# EAGLE schematic falownik (EAGLE 9.0.1)

## Sheet 1 of 3
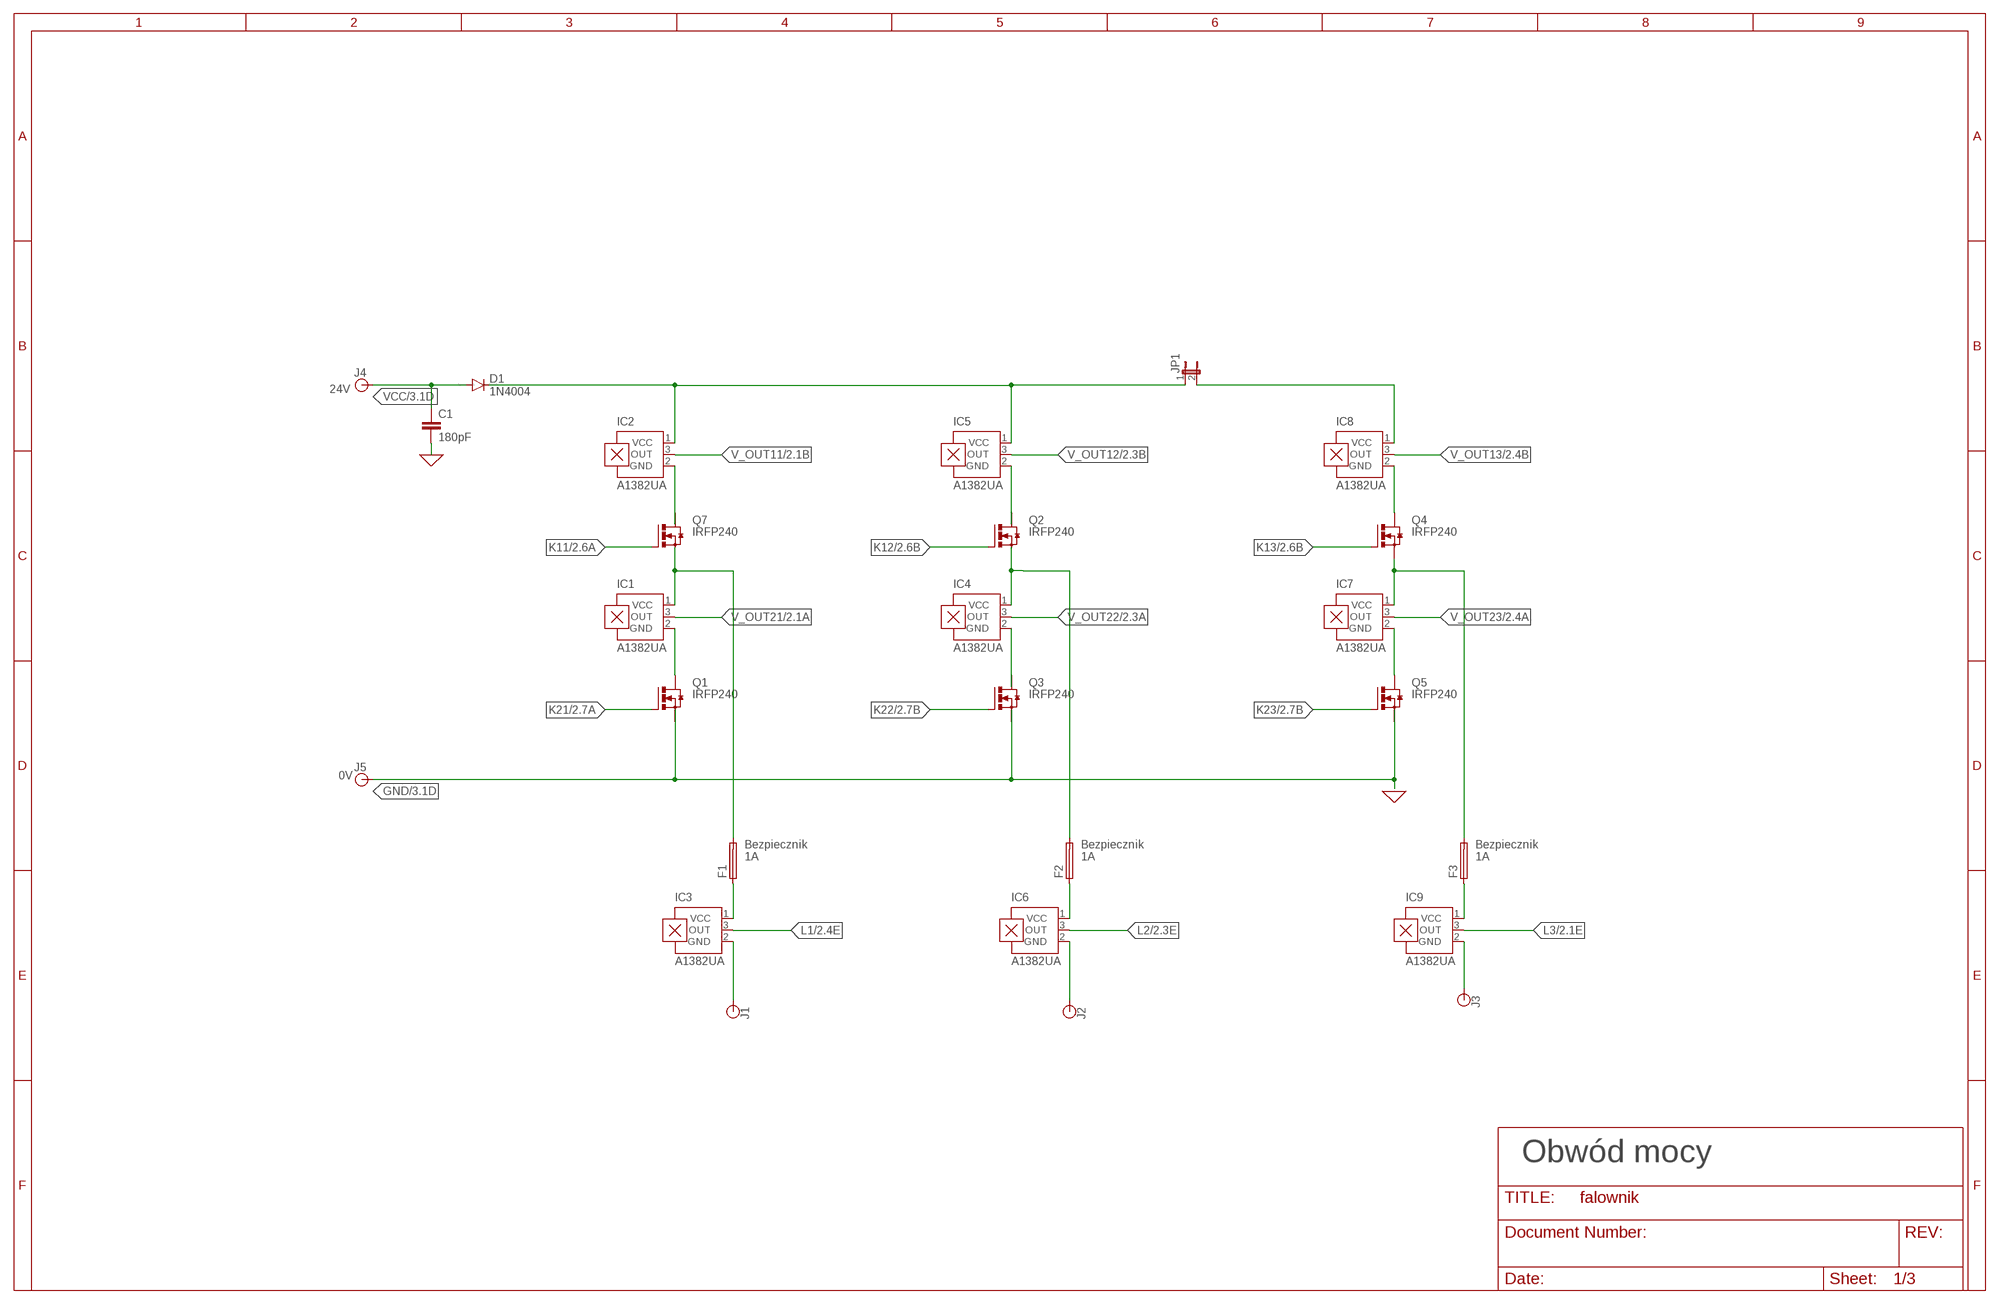
[diagram p0: schematic, sheet 1]

### Parts
C1  180pF  180PF-0603-50V-5%  [0603]
D1  1N4004  [DO41-10]
F1  GSH15  [GSH15]
F2  GSH15  [GSH15]
F3  GSH15  [GSH15]
IC1  A1382UA  [SIP3-UA]
IC2  A1382UA  [SIP3-UA]
IC3  A1382UA  [SIP3-UA]
IC4  A1382UA  [SIP3-UA]
IC5  A1382UA  [SIP3-UA]
IC6  A1382UA  [SIP3-UA]
IC7  A1382UA  [SIP3-UA]
IC8  A1382UA  [SIP3-UA]
IC9  A1382UA  [SIP3-UA]
J1  BANANA_CONN  [BANANA_CONN]
J2  BANANA_CONN  [BANANA_CONN]
J3  BANANA_CONN  [BANANA_CONN]
J4  BANANA_CONN  [BANANA_CONN]
J5  BANANA_CONN  [BANANA_CONN]
JP1  JP1E  [JP1]
Q1  IRFP240  [TO247BV]
Q2  IRFP240  [TO247BV]
Q3  IRFP240  [TO247BV]
Q4  IRFP240  [TO247BV]
Q5  IRFP240  [TO247BV]
Q7  IRFP240  [TO247BV]

### Nets
GND: C1.2 J5.P$1 Q1.S Q3.S Q5.S ; also sheet 3
K11: Q7.G ; also sheet 2
K12: Q2.G ; also sheet 2
K13: Q4.G ; also sheet 2
K21: Q1.G ; also sheet 2
K22: Q3.G ; also sheet 2
K23: Q5.G ; also sheet 2
L1: IC3.3(OUT) ; also sheet 2
L2: IC6.3(OUT) ; also sheet 2
L3: IC9.3(OUT) ; also sheet 2
N$1: IC2.2(GND) Q7.D
N$2: IC3.2(GND) J1.P$1
N$3: IC1.2(GND) Q1.D
N$4: F1.2 IC1.1(VCC) Q7.S
N$5: IC6.2(GND) J2.P$1
N$6: IC9.2(GND) J3.P$1
N$7: F1.1 IC3.1(VCC)
N$8: F2.1 IC6.1(VCC)
N$9: F3.1 IC9.1(VCC)
N$10: D1.C IC2.1(VCC) IC5.1(VCC) JP1.1
N$11: IC8.1(VCC) JP1.2
N$12: IC5.2(GND) Q2.D
N$14: IC4.2(GND) Q3.D
N$15: F2.2 IC4.1(VCC) Q2.S
N$23: IC8.2(GND) Q4.D
N$25: IC7.2(GND) Q5.D
N$26: F3.2 IC7.1(VCC) Q4.S
V_OUT11: IC2.3(OUT) ; also sheet 2
V_OUT12: IC5.3(OUT) ; also sheet 2
V_OUT13: IC8.3(OUT) ; also sheet 2
V_OUT21: IC1.3(OUT) ; also sheet 2
V_OUT22: IC4.3(OUT) ; also sheet 2
V_OUT23: IC7.3(OUT) ; also sheet 2
VCC: C1.1 D1.A J4.P$1 ; also sheet 3

### Notes on the sheet
- 24V
- 0V
- Bezpiecznik
  1A
- Bezpiecznik
  1A
- Bezpiecznik
  1A
- Obwód mocy

## Sheet 2 of 3
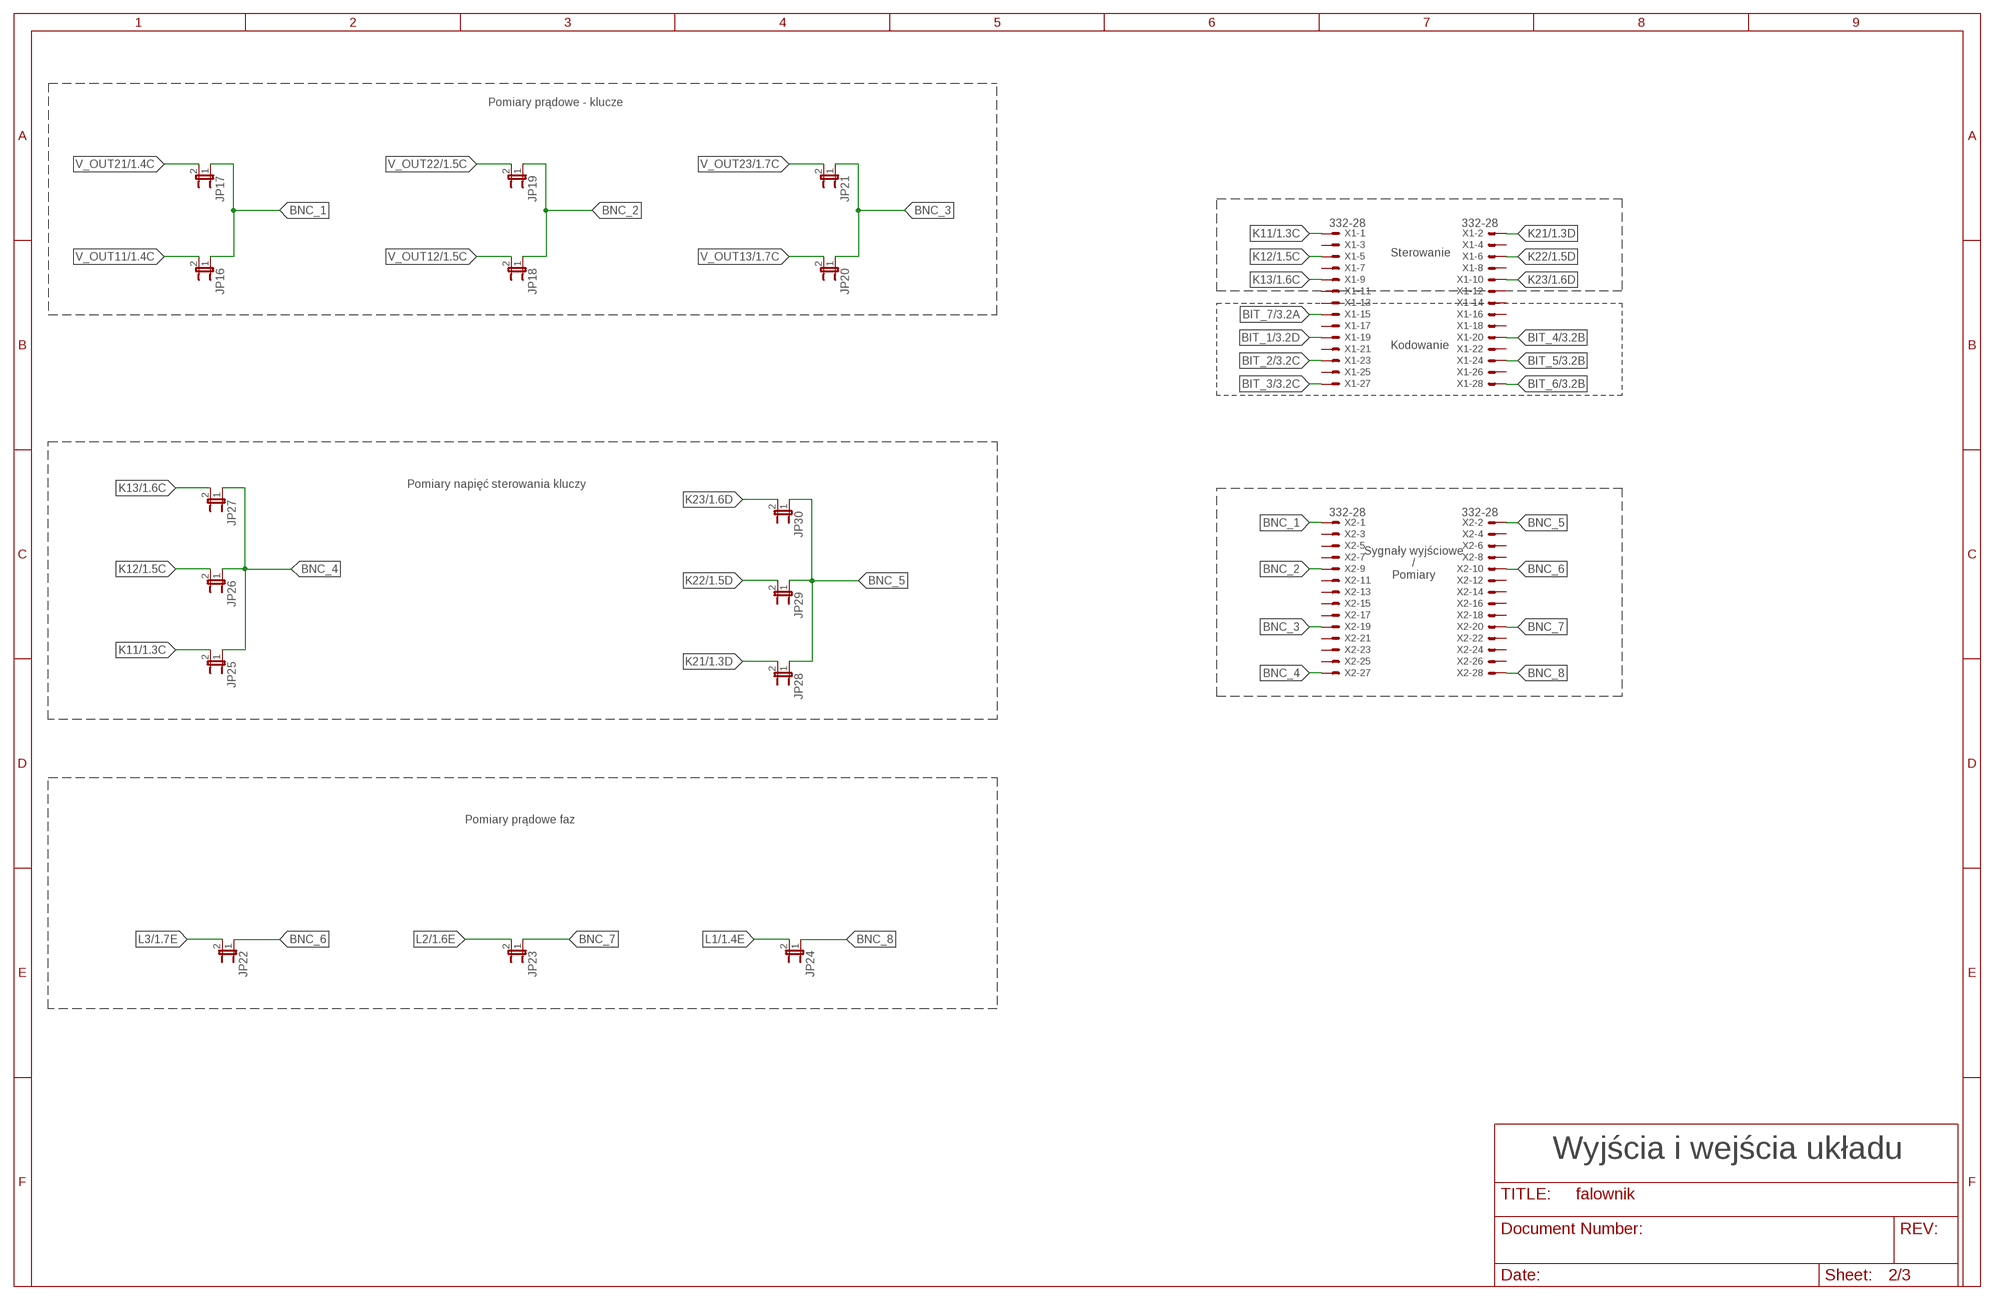
[diagram p1: schematic, sheet 2]

### Parts
JP16  JP1E  [JP1]
JP17  JP1E  [JP1]
JP18  JP1E  [JP1]
JP19  JP1E  [JP1]
JP20  JP1E  [JP1]
JP21  JP1E  [JP1]
JP22  JP1E  [JP1]
JP23  JP1E  [JP1]
JP24  JP1E  [JP1]
JP25  JP1E  [JP1]
JP26  JP1E  [JP1]
JP27  JP1E  [JP1]
JP28  JP1E  [JP1]
JP29  JP1E  [JP1]
JP30  JP1E  [JP1]
X1  332-28  [332-28]
X2  332-28  [332-28]

### Nets
BIT_1: X1.19 ; also sheet 3
BIT_2: X1.23 ; also sheet 3
BIT_3: X1.27 ; also sheet 3
BIT_4: X1.20 ; also sheet 3
BIT_5: X1.24 ; also sheet 3
BIT_6: X1.28 ; also sheet 3
BIT_7: X1.15 ; also sheet 3
BNC_1: JP16.1 JP17.1 X2.1
BNC_2: JP18.1 JP19.1 X2.9
BNC_3: JP20.1 JP21.1 X2.19
BNC_4: JP25.1 JP26.1 JP27.1 X2.27
BNC_5: JP28.1 JP29.1 JP30.1 X2.2
BNC_6: JP22.1 X2.10
BNC_7: JP23.1 X2.20
BNC_8: JP24.1 X2.28
K11: JP25.2 X1.1 ; also sheet 1
K12: JP26.2 X1.5 ; also sheet 1
K13: JP27.2 X1.9 ; also sheet 1
K21: JP28.2 X1.2 ; also sheet 1
K22: JP29.2 X1.6 ; also sheet 1
K23: JP30.2 X1.10 ; also sheet 1
L1: JP24.2 ; also sheet 1
L2: JP23.2 ; also sheet 1
L3: JP22.2 ; also sheet 1
V_OUT11: JP16.2 ; also sheet 1
V_OUT12: JP18.2 ; also sheet 1
V_OUT13: JP20.2 ; also sheet 1
V_OUT21: JP17.2 ; also sheet 1
V_OUT22: JP19.2 ; also sheet 1
V_OUT23: JP21.2 ; also sheet 1
Unconnected: X1.3 X1.4 X1.7 X1.8 X1.11 X1.12 X1.13 X1.14 X1.16 X1.17 X1.18 X1.21 X1.22 X1.25 X1.26 X2.3 X2.4 X2.5 X2.6 X2.7 X2.8 X2.11 X2.12 X2.13 X2.14 X2.15 X2.16 X2.17 X2.18 X2.21 X2.22 X2.23 X2.24 X2.25 X2.26

### Notes on the sheet
- Pomiary prądowe - klucze
- Sterowanie
- Kodowanie
- Pomiary napięć sterowania kluczy
- Sygnały wyjściowe
  /
  Pomiary
- Pomiary prądowe faz
- Wyjścia i wejścia układu

## Sheet 3 of 3
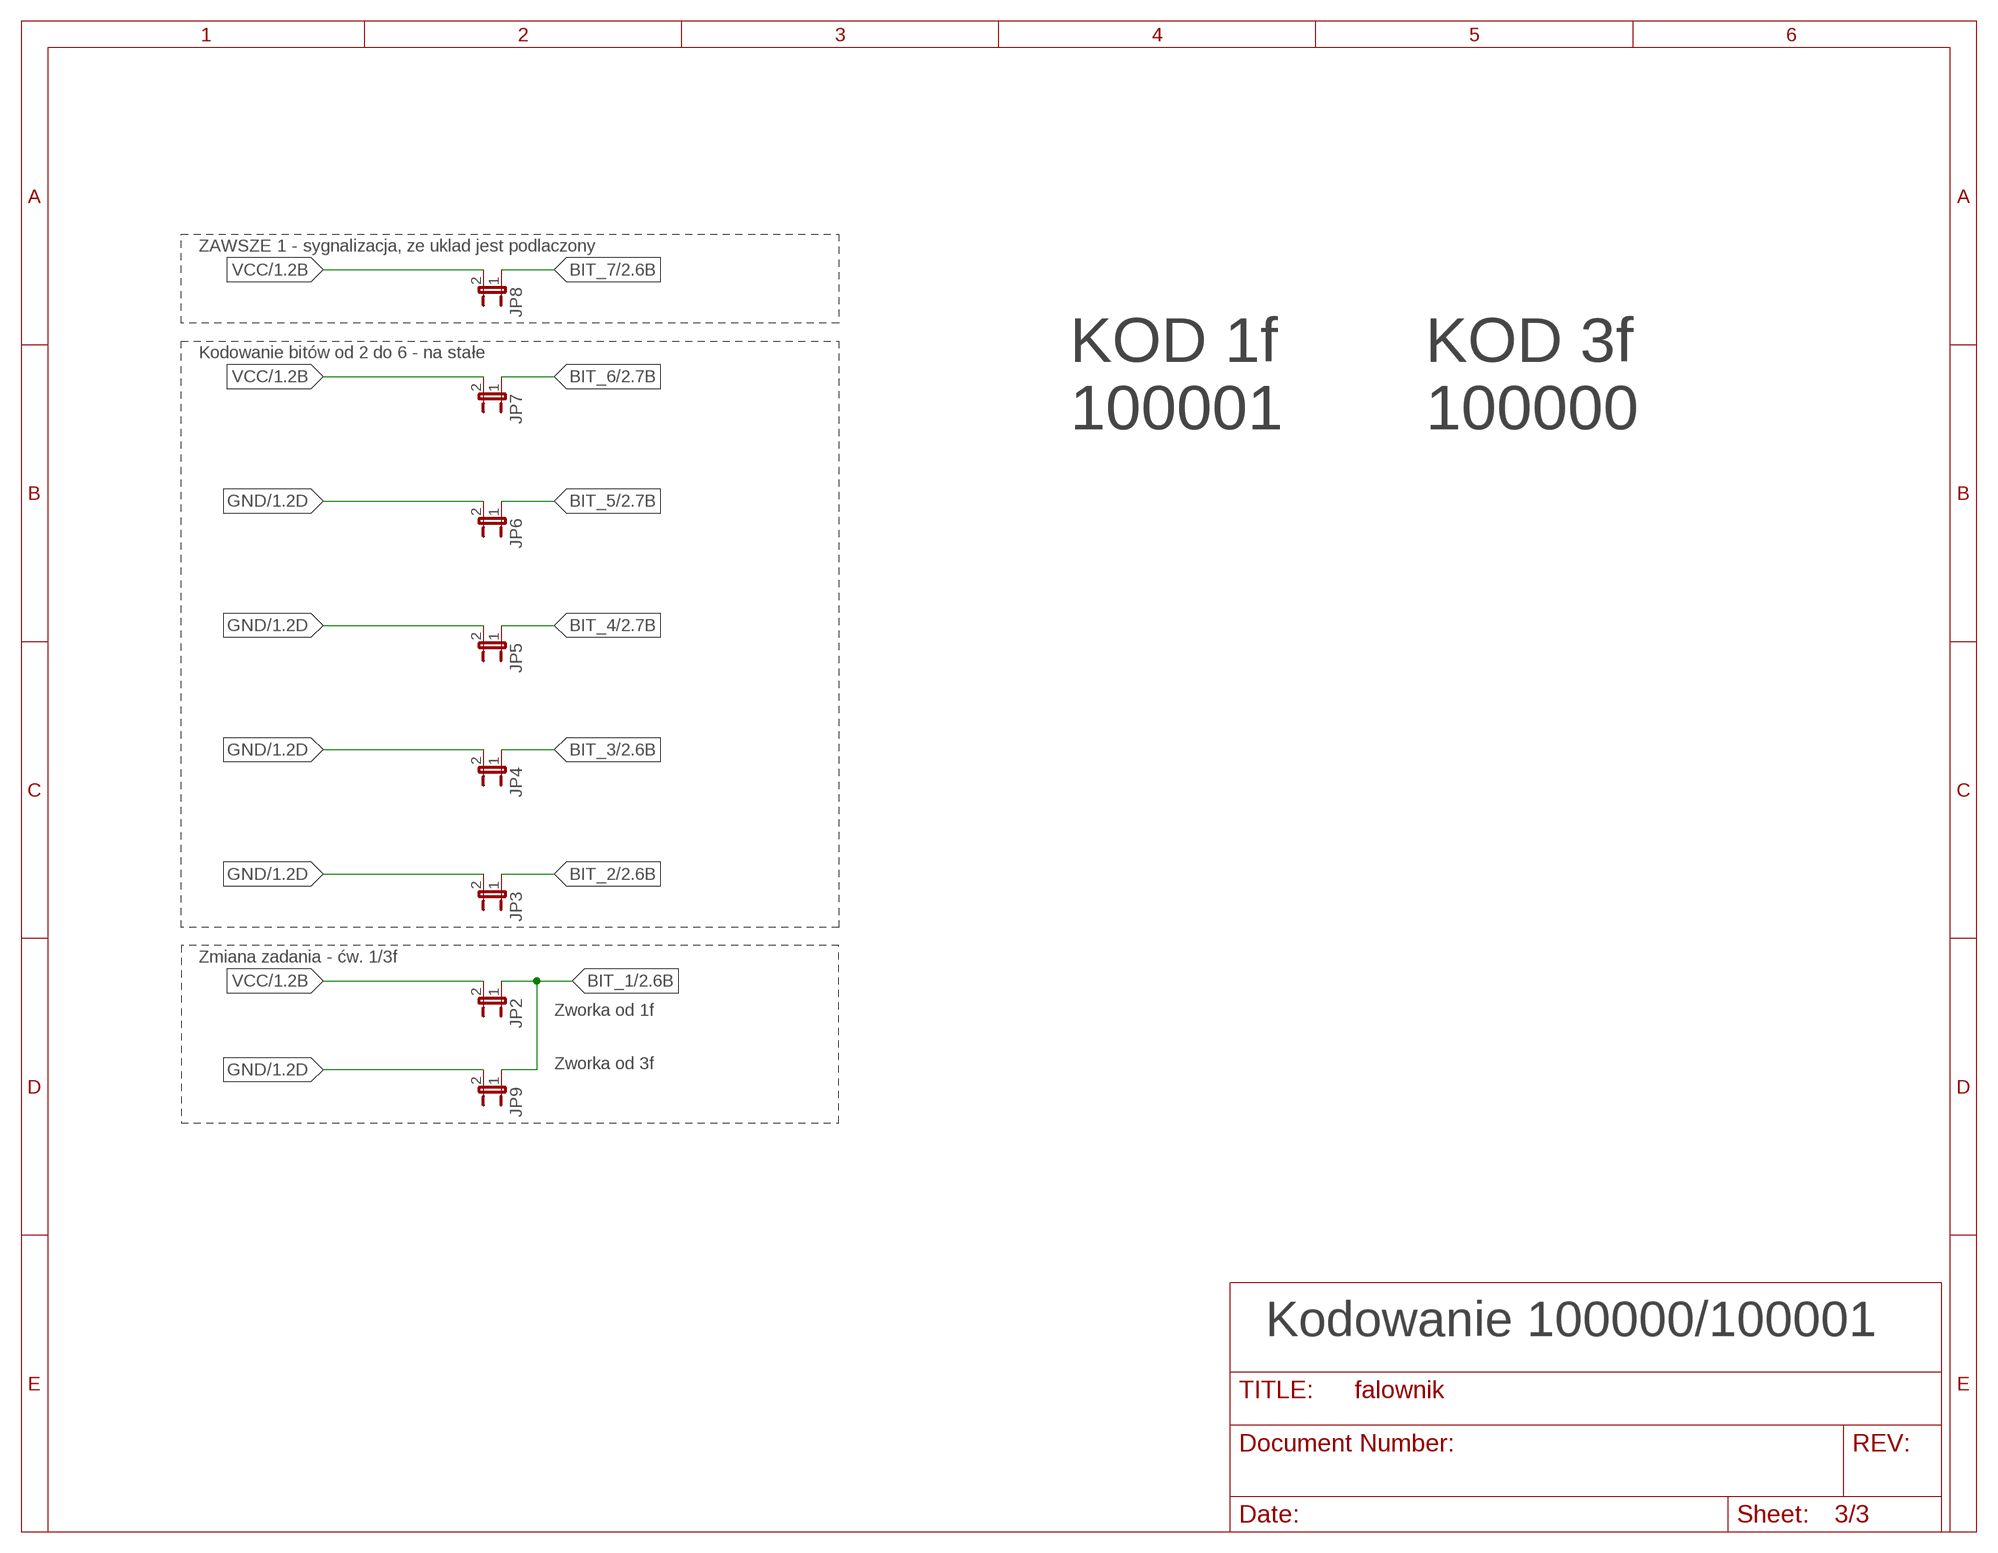
[diagram p2: schematic, sheet 3]

### Parts
JP2  JP1E  [JP1]
JP3  JP1E  [JP1]
JP4  JP1E  [JP1]
JP5  JP1E  [JP1]
JP6  JP1E  [JP1]
JP7  JP1E  [JP1]
JP8  JP1E  [JP1]
JP9  JP1E  [JP1]

### Nets
BIT_1: JP2.1 JP9.1 ; also sheet 2
BIT_2: JP3.1 ; also sheet 2
BIT_3: JP4.1 ; also sheet 2
BIT_4: JP5.1 ; also sheet 2
BIT_5: JP6.1 ; also sheet 2
BIT_6: JP7.1 ; also sheet 2
BIT_7: JP8.1 ; also sheet 2
GND: JP3.2 JP4.2 JP5.2 JP6.2 JP9.2 ; also sheet 1
VCC: JP2.2 JP7.2 JP8.2 ; also sheet 1

### Notes on the sheet
- ZAWSZE 1 - sygnalizacja, ze uklad jest podlaczony
- Kodowanie bitów od 2 do 6 - na stałe
- KOD 1f
  100001
- KOD 3f
  100000
- Zmiana zadania - ćw. 1/3f
- Zworka od 1f
- Zworka od 3f
- Kodowanie 100000/100001

## Library data of the parts
C1 = SparkFun-Capacitors:180PF: 180pF/0.18nF ceramic capacitors A capacitor is a passive two-terminal electrical component used to store electrical energy temporarily in an electric field.; PROD_ID: CAP-11661
D1 = diode:1N4004: DIODE general purpose rectifier, 1 A
F1-F3 = fuse:GSH15: FUSE HOLDER grid 15mm, 19649 Wickmann; MPN: 64900001039; OC_FARNELL: 1271673; OC_NEWARK: 02P0318
IC1-IC9 = allegro:A13*?: Linear Hall Effect Sensor ICs Continuous-Time Ratiometric High-Temperature Operation Programmable Linear with Analog Output A1302 -Replacement- UGN3503 Source: http://www.allegromicro.com/en/Products/Part_Numbers/1301/1301.pdf http://www.allegromicro.com/en/Products/Part_Numbers/1321/1321.pdf http://www.allegromicro.com/en/Products/Part_Numbers/1381/1381.pdf; MPN: A1382LUA-T; OC_FARNELL: unknown; OC_NEWARK: 30M9953
J1-J5 = SparkFun-Connectors:BANANA_CONN: Through-hole Banana Jack Basic PTH connection for banana jack plugs SparkFun Products: Multimeter Kit <https://www.sparkfun.com/products/retired/10956> Banana to Alligator Cable <https://www.sparkfun.com/products/retired/509> Banana to Alligator Coax Cable <https://www.sparkfun.com/products/retired/508> Banana to Banana Cable <https://www.sparkfun.com/products/retired/507> Banana to IC Hook Cables <https://www.sparkfun.com/products/retired/506>
JP1-JP9 JP16-JP30 = jumper:JP1E: JUMPER
Q1-Q5 Q7 = transistor-power:IRFP240: HEXFET Power MosFet Source: http://www.irf.com/
X1 X2 = con-garry:332-28: 28 Pin - 2mm Dual Row Source: www.mpe-connector.de / garry_shortform_2012.pdf